# Altium schematic sheet Sheet1.SchDoc
size A4; SheetNumber: 1; SheetTotal: 1
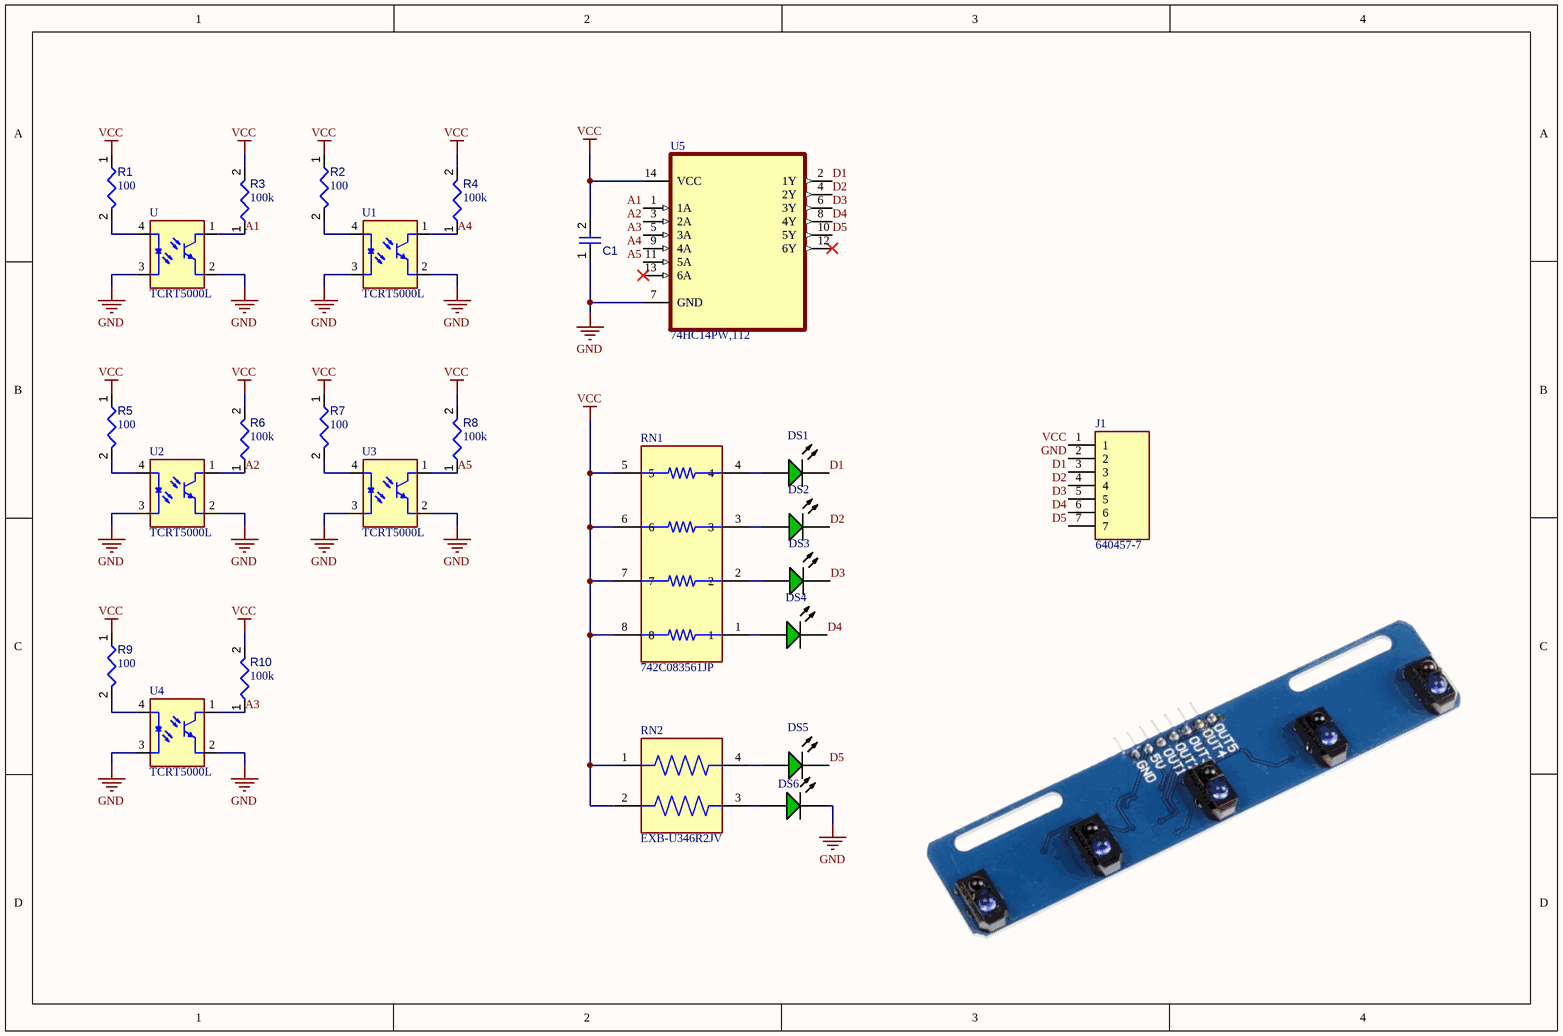
[diagram p0: Sheet1.SchDoc]

## Parts
C1  Capacitor 1 uF +/- 10% 25 V 0805  [CAPC2013X145X50ML20T25]  (value not drawn)
DS1  HSMG-C190  [AVAG-HSMX-C190_V]  (value not drawn)
DS2  HSMG-C190  [AVAG-HSMX-C190_V]  (value not drawn)
DS3  HSMG-C190  [AVAG-HSMX-C190_V]  (value not drawn)
DS4  HSMG-C190  [AVAG-HSMX-C190_V]  (value not drawn)
DS5  HSMG-C190  [AVAG-HSMX-C190_V]  (value not drawn)
DS6  HSMG-C190  [AVAG-HSMX-C190_V]  (value not drawn)
J1  640457-7  [TE_640457-7]
R1  value 100  [RESC0402(1005)_L]  (hidden comment: Resistor 100R +/-1 % 0402 63 mW)
R2  value 100  [RESC0402(1005)_L]  (hidden comment: Resistor 100R +/-1 % 0402 63 mW)
R3  value 100k  [RESC1005X40X25ML05T05]  (hidden comment: Resistor 100k +/-1% 0402 63 mW)
R4  value 100k  [RESC1005X40X25ML05T05]  (hidden comment: Resistor 100k +/-1% 0402 63 mW)
R5  value 100  [RESC0402(1005)_L]  (hidden comment: Resistor 100R +/-1 % 0402 63 mW)
R6  value 100k  [RESC1005X40X25ML05T05]  (hidden comment: Resistor 100k +/-1% 0402 63 mW)
R7  value 100  [RESC0402(1005)_L]  (hidden comment: Resistor 100R +/-1 % 0402 63 mW)
R8  value 100k  [RESC1005X40X25ML05T05]  (hidden comment: Resistor 100k +/-1% 0402 63 mW)
R9  value 100  [RESC0402(1005)_L]  (hidden comment: Resistor 100R +/-1 % 0402 63 mW)
R10  value 100k  [RESC1005X40X25ML05T05]  (hidden comment: Resistor 100k +/-1% 0402 63 mW)
RN1  742C083561JP  [RESCAV80P320X160X70-8N]
RN2  EXB-U346R2JV  [RESCAXE_EXB-U346R2JV]
U  TCRT5000L  [XDCR_TCRT5000L]
U1  TCRT5000L  [XDCR_TCRT5000L]
U2  TCRT5000L  [XDCR_TCRT5000L]
U3  TCRT5000L  [XDCR_TCRT5000L]
U4  TCRT5000L  [XDCR_TCRT5000L]
U5  74HC14PW,112  [SOP65P640X110-14N]

## Nets
GND: C1.1 DS6.2(K) J1.2 U.2(E) U.3(C) U1.2(E) U1.3(C) U2.2(E) U2.3(C) U3.2(E) U3.3(C) U4.2(E) U4.3(C) U5.7(GND)
VCC: C1.2 J1.1 R1.1 R2.1 R3.2 R4.2 R5.1 R6.2 R7.1 R8.2 R9.1 R10.2 RN1.5 RN1.6 RN1.7 RN1.8 RN2.1 RN2.2 U5.14(VCC)
A1: R3.1 U.1(CO) U5.1(1A)
A2: R6.1 U2.1(CO) U5.3(2A)
A3: R10.1 U4.1(CO) U5.5(3A)
A4: R4.1 U1.1(CO) U5.9(4A)
A5: R8.1 U3.1(CO) U5.11(5A)
D1: DS1.2(K) J1.3 U5.2(1Y)
D2: DS2.2(K) J1.4 U5.4(2Y)
D3: DS3.2(K) J1.5 U5.6(3Y)
D4: DS4.2(K) J1.6 U5.8(4Y)
D5: DS5.2(K) J1.7 U5.10(5Y)
NetDS1_1: DS1.1(A) RN1.4
NetDS2_1: DS2.1(A) RN1.3
NetDS3_1: DS3.1(A) RN1.2
NetDS4_1: DS4.1(A) RN1.1
NetDS5_1: DS5.1(A) RN2.4
NetDS6_1: DS6.1(A) RN2.3
NetR1_2: R1.2 U.4(A)
NetR2_2: R2.2 U1.4(A)
NetR5_2: R5.2 U2.4(A)
NetR7_2: R7.2 U3.4(A)
NetR9_2: R9.2 U4.4(A)

Not connected (* = marked no-connect by the designer): U5 12(6Y)* 13(6A)*

## Library data of the parts
C1 = CMP-001-00010-6: Chip Capacitor, 1 uF, +/-10%, 25 V, 0805 (2012 Metric); Value: 1µF; Capacitor Type: Ceramic; Voltage Rating: 25V; RoHS Compliant: True; Pins: 2; Mounting Technology: SM; Max Operating Temperature: 125°C; Min Operating Temperature: -55°C; Tolerance: 10%; Case/Package: 0805
DS1-DS6 = CMP-007-00013-2: LED Uni-Color Green, 52 mW, 20 mA, -40 to 85 degC, 2-Pin SMD, RoHS, Tape and Reel; Manufacturer: Avago; Forward Current: 20mA; Viewing Angle: 170degrees; Luminous Intensity: 15mcd; Lens Style: Diffused; Forward Voltage: 2.2V; Power: 52mW; Mounting Technology: SM; RoHS Compliant: True; Packaging: TapeandReel; Illumination Colour: Green; Datasheet URL: http://docs.avagotech.com/docs/AV02-0551EN; Min Operating Temperature: -40°C; Max Operating Temperature: 85°C; Pins: 2; Package Description: 2-Pin Surface Mount Device, Body 1.6 x 0.8 mm, Height 0.9 mm; Nominal Vf: 2.2V; Case/Package: 0603; Manufacturer URL: http://www.avagotech.com/; Datasheet Version: Mar-12; Colour: Green; Package Reference: HSMX-C190; Package Quantity: 4000
J1 = 640457-7: 07P MTA100 HDR ASSY SQ R/A F/L; MF: TE Connectivity; Number_of_Positions: 7; Centerline_Pitch: 2.54 mm[.1 in]; Product_Type: Connector; Price: None; SnapEDA_Link: https://www.snapeda.com/parts/640457-7/TE%20Connectivity%20AMP%20Connectors/view-part/554536/?ref=snap; EU_RoHS_Compliance: Compliant; Availability: Good; Purchase-URL: https://pricing.snapeda.com/search/part/640457-7/?ref=eda; Value: *; MP: 640457-7; Package: None; Check_prices: https://www.snapeda.com/parts/640457-7/TE%20Connectivity%20AMP%20Connectors/view-part/554536/?ref=eda
R1 R2 R5 R7 R9 = CMP-009-00167-3: Chip Resistor, 100 Ohms, +/-1 %, 63 mW, -55 to 155 degC, 0402; Power: 63mW; Tolerance: 1%; Min Operating Temperature: -55°C; Case/Package: 0402; Pins: 2; Max Operating Temperature: 155°C
R3 R4 R6 R8 R10 = CMP-009-00021-5: Chip Resistor, 100 KOhm, +/- 1%, 0.063 W, -55 to 155 degC, 0402 (1005 Metric); Voltage Rating: 50V; Power: 63mW; Pins: 2; Tolerance: 1%; Max Operating Temperature: 155°C; Case/Package: 0402; Min Operating Temperature: -55°C; Mounting Technology: SM; RoHS Compliant: True
RN1 = 742C083561JP: 560 Ohm Â±5% 62.5mW Power Per Element Isolated Resistor Network/Array Â±200ppm/Â°C 1206 (3216 Metric), Concave, Long Side Terminals; MF: CTS Resistor; SnapEDA_Link: https://www.snapeda.com/parts/742C083561JP/CTS+Components/view-part/?ref=snap; Package: 1206 CTS Resistor; Value: *; MP: 742C083561JP; Check_prices: https://www.snapeda.com/parts/742C083561JP/CTS+Components/view-part/?ref=eda
RN2 = EXB-U346R2JV: Series/Type: Anti-Sulfurated Chip Resistor Array, Power Rating (W): 0.063, Chip Size (LxW) (mm): 1.6 X 1.6, Resistance Values (â„¦): 6, Resistance Tolerance (%): 5, Terminal Pitch (mm): 0.8, Type of Circuit: Isolated Circuit, Number of Elements (piece): 2; MF: Panasonic; SnapEDA_Link: https://www.snapeda.com/parts/EXB-U346R2JV/Panasonic/view-part/?ref=snap; Package: NON STANDARD-4 Panasonic; Value: *; MP: EXB-U346R2JV; Check_prices: https://www.snapeda.com/parts/EXB-U346R2JV/Panasonic/view-part/?ref=eda
U U1-U4 = TCRT5000L: Reflective Optical Sensor 0.591 _15mm_ PCB Mount; MF: Vishay; MP: TCRT5000L; Package: PCB Mount Vishay Semiconductor; SnapEDA_Link: https://www.snapeda.com/parts/TCRT5000L/Vishay%20Semiconductor%20Opto%20Division/view-part/229608/?ref=snap; Availability: Unavailable; Value: *; Price: None
U5 = 74HC14PW,112: Inverter IC 6 Channel Schmitt Trigger 14-TSSOP; MF: Nexperia; Purchase-URL: https://pricing.snapeda.com/search/part/74HC14PW,112/?ref=eda; Value: *; MP: 74HC14PW,112; Package: TSSOP14-14 Nexperia USA Inc.; Price: None; SnapEDA_Link: https://www.snapeda.com/parts/74HC14PW,112/Nexperia/view-part/1039907/?ref=snap; Availability: Good; Check_prices: https://www.snapeda.com/parts/74HC14PW,112/Nexperia/view-part/1039907/?ref=eda